# EAGLE schematic Power Bus (EAGLE 9.6.2)
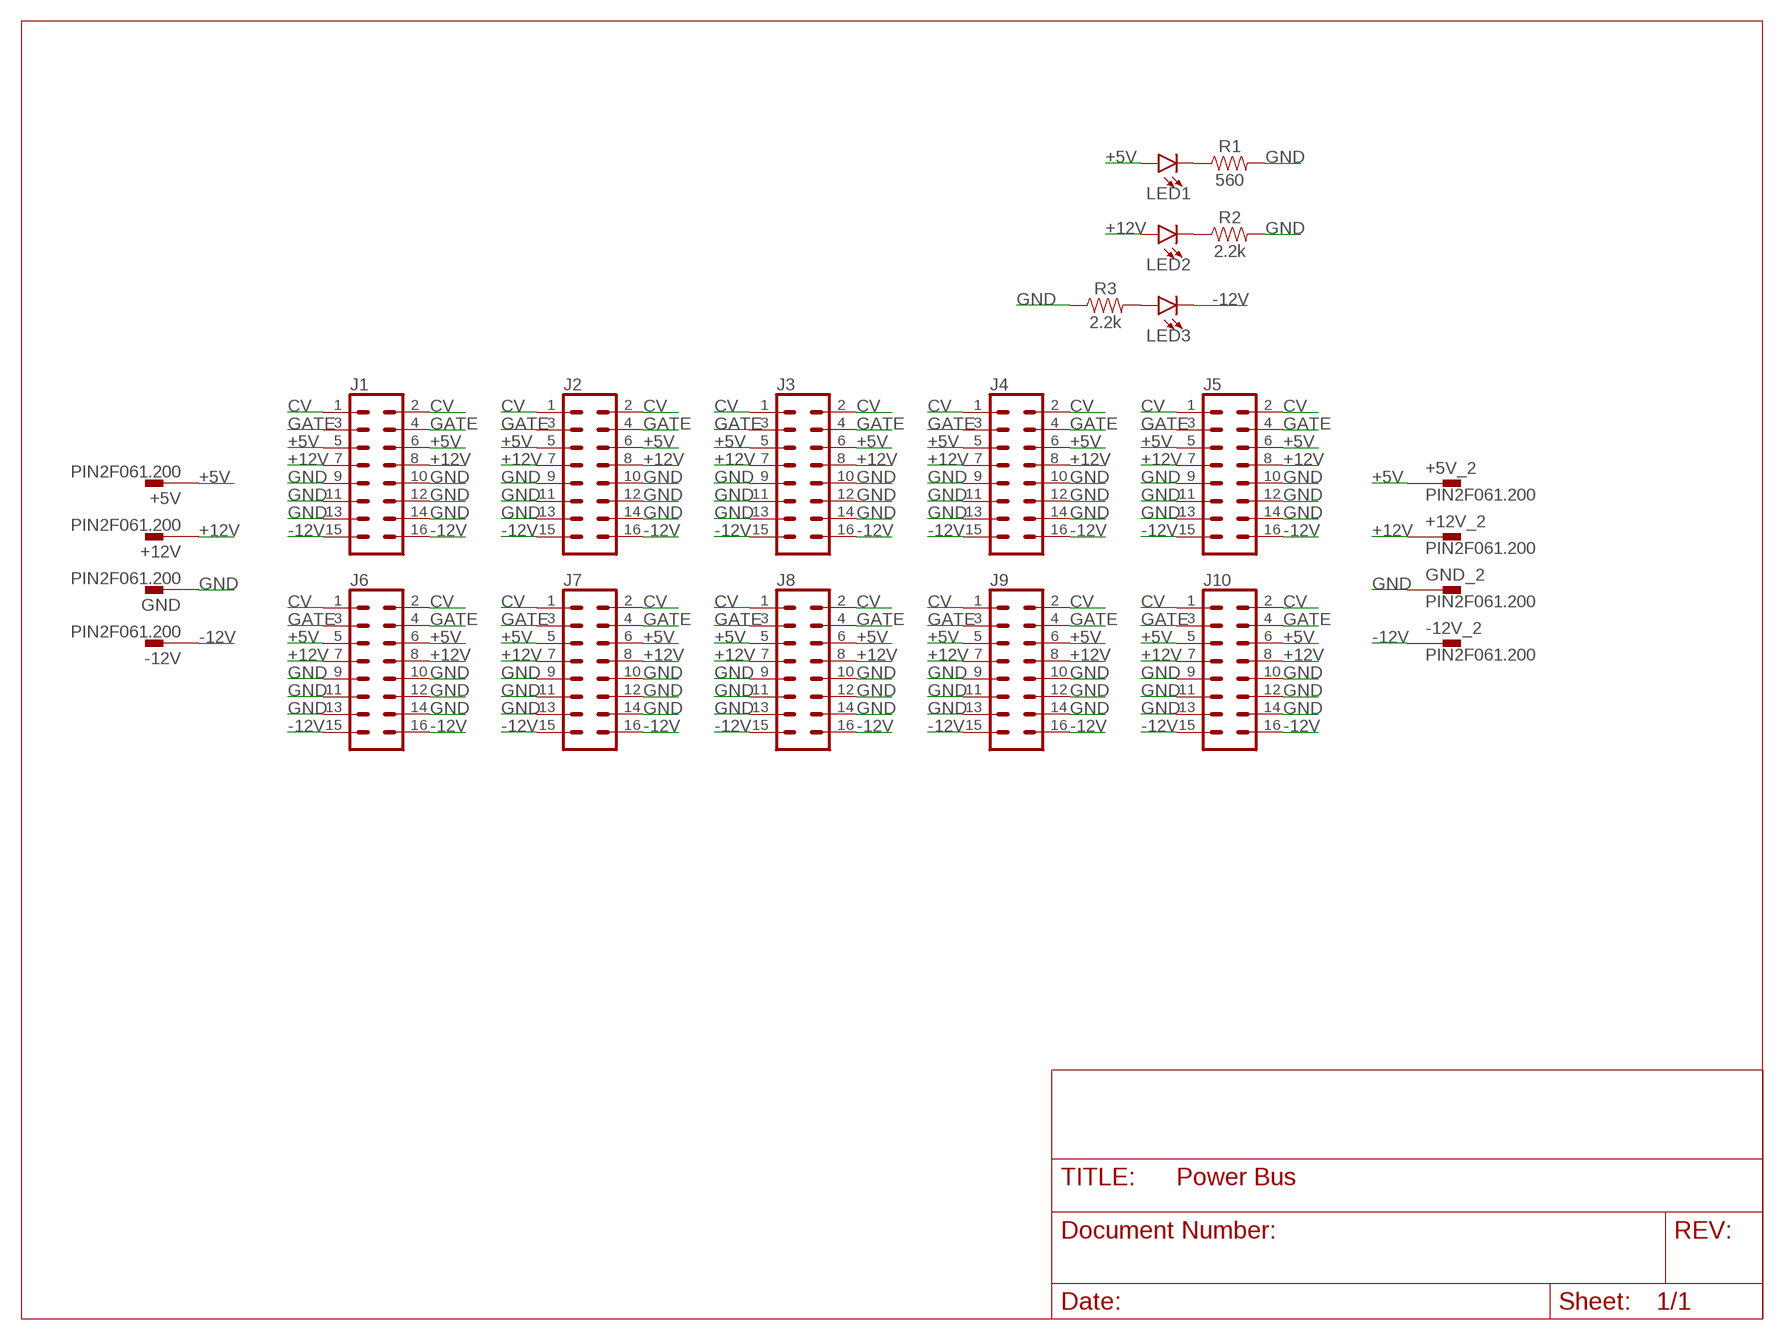
[diagram p0: schematic, sheet 1]

## Parts
+5V  PIN2F061.200  [F061.200]
+5V_2  PIN2F061.200  [F061.200]
+12V  PIN2F061.200  [F061.200]
+12V_2  PIN2F061.200  [F061.200]
-12V  PIN2F061.200  [F061.200]
-12V_2  PIN2F061.200  [F061.200]
GND  PIN2F061.200  [F061.200]
GND_2  PIN2F061.200  [F061.200]
J1  CONN_08X2_HEADER  [2X8]
J2  CONN_08X2_HEADER  [2X8]
J3  CONN_08X2_HEADER  [2X8]
J4  CONN_08X2_HEADER  [2X8]
J5  CONN_08X2_HEADER  [2X8]
J6  CONN_08X2_HEADER  [2X8]
J7  CONN_08X2_HEADER  [2X8]
J8  CONN_08X2_HEADER  [2X8]
J9  CONN_08X2_HEADER  [2X8]
J10  CONN_08X2_HEADER  [2X8]
LED1  LED3MM  [LED_3MM]
LED2  LED3MM  [LED_3MM]
LED3  LED3MM  [LED_3MM]
R1  560  1KOHM-HORIZ-1/4W-5%  [AXIAL-0.3]
R2  2.2k  1KOHM-HORIZ-1/4W-5%  [AXIAL-0.3]
R3  2.2k  1KOHM-HORIZ-1/4W-5%  [AXIAL-0.3]

## Nets
+5V: +5V.1A +5V.1B +5V_2.1A +5V_2.1B J1.5 J1.6 J2.5 J2.6 J3.5 J3.6 J4.5 J4.6 J5.5 J5.6 J6.5 J6.6 J7.5 J7.6 J8.5 J8.6 J9.5 J9.6 J10.5 J10.6 LED1.A
+12V: +12V.1A +12V.1B +12V_2.1A +12V_2.1B J1.7 J1.8 J2.7 J2.8 J3.7 J3.8 J4.7 J4.8 J5.7 J5.8 J6.7 J6.8 J7.7 J7.8 J8.7 J8.8 J9.7 J9.8 J10.7 J10.8 LED2.A
-12V: -12V.1A -12V.1B -12V_2.1A -12V_2.1B J1.15 J1.16 J2.15 J2.16 J3.15 J3.16 J4.15 J4.16 J5.15 J5.16 J6.15 J6.16 J7.15 J7.16 J8.15 J8.16 J9.15 J9.16 J10.15 J10.16 LED3.K(C)
CV: J1.1 J1.2 J2.1 J2.2 J3.1 J3.2 J4.1 J4.2 J5.1 J5.2 J6.1 J6.2 J7.1 J7.2 J8.1 J8.2 J9.1 J9.2 J10.1 J10.2
GATE: J1.3 J1.4 J2.3 J2.4 J3.3 J3.4 J4.3 J4.4 J5.3 J5.4 J6.3 J6.4 J7.3 J7.4 J8.3 J8.4 J9.3 J9.4 J10.3 J10.4
GND: GND.1A GND.1B GND_2.1A GND_2.1B J1.9 J1.10 J1.11 J1.12 J1.13 J1.14 J2.9 J2.10 J2.11 J2.12 J2.13 J2.14 J3.9 J3.10 J3.11 J3.12 J3.13 J3.14 J4.9 J4.10 J4.11 J4.12 J4.13 J4.14 J5.9 J5.10 J5.11 J5.12 J5.13 J5.14 J6.9 J6.10 J6.11 J6.12 J6.13 J6.14 J7.9 J7.10 J7.11 J7.12 J7.13 J7.14 J8.9 J8.10 J8.11 J8.12 J8.13 J8.14 J9.9 J9.10 J9.11 J9.12 J9.13 J9.14 J10.9 J10.10 J10.11 J10.12 J10.13 J10.14 R1.P$2 R2.P$2 R3.P$1
N$1: LED1.K(C) R1.P$1
N$2: LED2.K(C) R2.P$1
N$6: LED3.A R3.P$2

## Library data of the parts
+5V +5V_2 +12V +12V_2 -12V -12V_2 GND GND_2 = my-library:PIN2: Flachstecker Typ Tyco/Electronics/AMP TAB, FASTON Printed Circuit Board Tabs Source: http://www.buerklin.com, http://catalog.tycoelectronics.com; OC_FARNELL: unknown; OC_NEWARK: unknown
J1-J10 = my-library:CONN_08X2: Multi connection point. Often used as Generic Header-pin footprint for 0.1 inch spaced/style header connections You can populate with any combo of single row headers, but if you'd like an exact match, check this: Header - 2x8 (Male, 0.1") <https://www.sparkfun.com/products/13156> (PRT-13156) On any of the 0.1 inch spaced packages, you can populate with these: Break Away Headers - Straight <https://www.sparkfun.com/products/116> (PRT-00116) Break Away Male Headers - Right Angle <https://www.sparkfun.com/products/553> (PRT-00553) Female Headers <https://www.sparkfun.com/products/115> (PRT-00115) Break Away Headers - Machine Pin <https://www.sparkfun.com/products/117> (PRT-00117) Break Away Female Headers - Swiss Machine Pin <https://www.sparkfun.com/products/743> (PRT-00743)
LED1-LED3 = my-library:LED: LED (Generic) Standard schematic elements and footprints for 5mm, 3mm, 1206, and 0603 sized LEDs. Generic LEDs with no color specified.; PROD_ID: DIO-08794
R1-R3 = my-library:1KOHM: 1kΩ resistor A resistor is a passive two-terminal electrical component that implements electrical resistance as a circuit element. Resistors act to reduce current flow, and, at the same time, act to lower voltage levels within circuits. - Wikipedia; PROD_ID: RES-08380; VALUE: 1k